# EAGLE schematic resistor_divider (EAGLE 6.4)
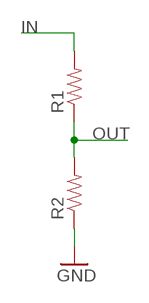
[diagram p0: schematic, sheet 1]

## Parts
R1  RESISTOR0402-RES  [0402-RES]
R2  RESISTOR0402-RES  [0402-RES]

## Nets
GND: R2.1
IN: R1.2
OUT: R1.1 R2.2

## Library data of the parts
R1 R2 = SparkFun-Passives:RESISTOR: Resistor Basic schematic elements and footprints for 0603, 1206, and PTH resistors.